# EAGLE design schematic_1.3 (EAGLE 7.3.0)
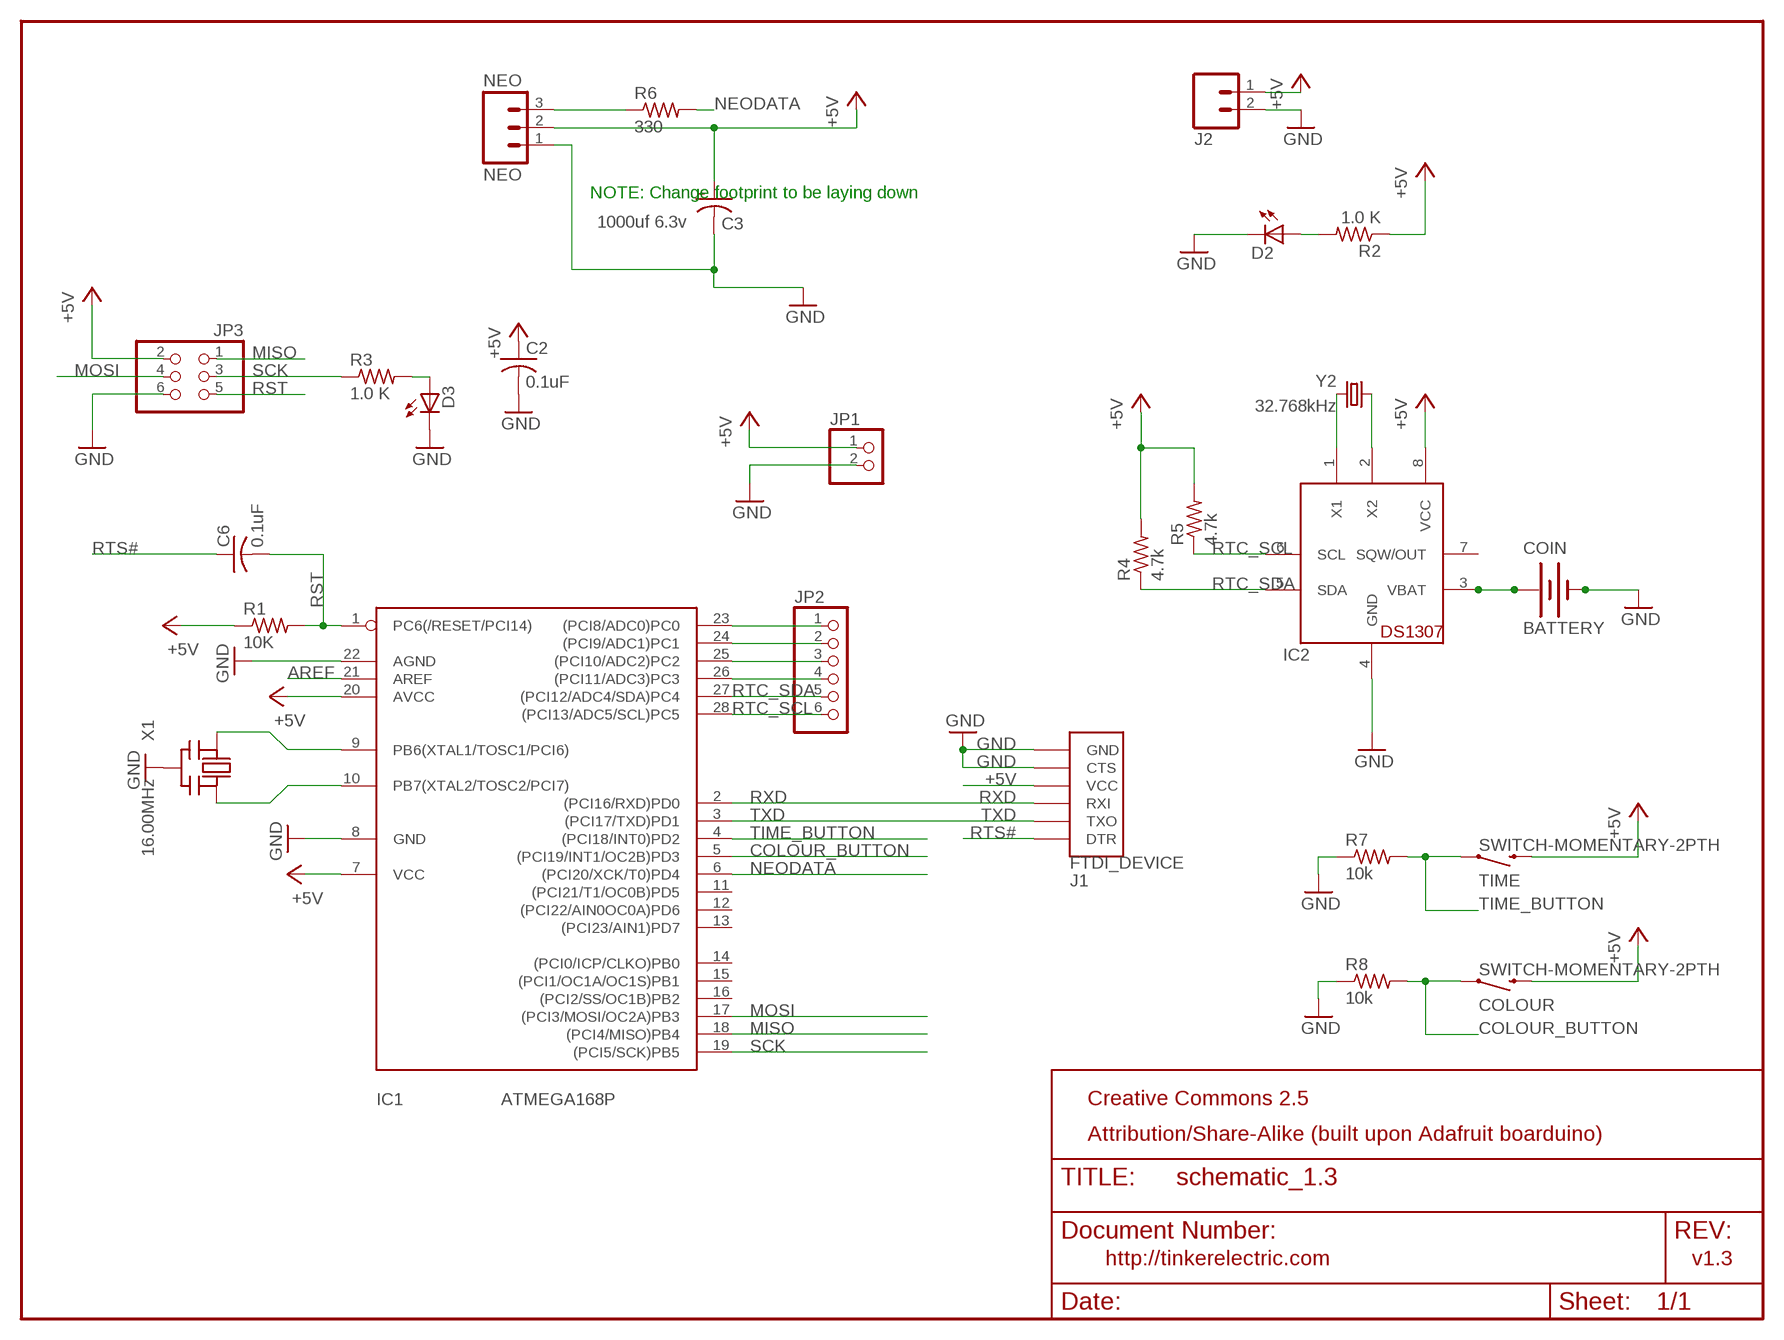
[diagram p0: schematic, sheet 1]

## Parts
C2  0.1uF  C-US025-025X050  [C025-025X050]
C3  1000uf 6.3v  CPOL-USE5-10.5  [E5-10,5]
C6  0.1uF  C-US025-025X050  [C025-025X050]
COIN  BATTERY  [BATTCOM_12MM]
COLOUR  SWITCH-MOMENTARY-2PTH  [TACTILE-PTH]
D2  LED3MM  [LED3MM]
D3  Green  LED3MM  [LED3MM]
IC1  ATMEGA168P  ATMEGA168PROUND  [DIL28/3]
IC2  DS1307  [DIL08]
J1  FTDI_DEVICE  [FTDI_DEVICE_SIDE]
J2  M02POLAR  [MOLEX-1X2]
JP1  PINHD-1X2CB  [1X02-CB]
JP2  PINHD-1X6CB  [1X06-CLEANBIG]
JP3  PINHD-2X3  [2X03]
NEO  NEO  M03POLAR  [MOLEX-1X3]
R1  10K  R-US_0204/2V  [0204V]
R2  1.0 K  R-US_0204/2V  [0204V]
R3  1.0 K  R-US_0204/2V  [0204V]
R4  4.7k  R-US_0204/2V  [0204V]
R5  4.7k  R-US_0204/2V  [0204V]
R6  330  R-US_0204/2V  [0204V]
R7  10k  R-US_0204/2V  [0204V]
R8  10k  R-US_0204/2V  [0204V]
TIME  SWITCH-MOMENTARY-2PTH  [TACTILE-PTH]
X1  16.00MHz  CERMOSCILL  [CERM_OSC]
Y2  32.768kHz  CRYSTALTC26H_EZ  [TC26HEZ]

## Nets
+5V: C2.1 C3.+ COLOUR.3 IC1.7(VCC) IC1.20(AVCC) IC2.8(VCC) J1.P$4(VCC) J2.1 JP1.1 JP3.2 NEO.2 R1.1 R2.1 R4.2 R5.2 TIME.3
AREF: IC1.21(AREF)
COLOUR_BUTTON: COLOUR.1 IC1.5((PCI19/INT1/OC2B)PD3) R8.2
GND: C2.2 C3.- COIN.- D2.K(C) D3.K(C) IC1.8(GND) IC1.22(AGND) IC2.4(GND) J1.P$5(CTS) J1.P$6(GND) J2.2 JP1.2 JP3.6 NEO.1 R7.1 R8.1 X1.P$2(GND)
MISO: IC1.18((PCI4/MISO)PB4) JP3.1
MOSI: IC1.17((PCI3/MOSI/OC2A)PB3) JP3.4
N$1: IC1.9(PB6(XTAL1/TOSC1/PCI6)) X1.P$1(IN)
N$2: IC1.10(PB7(XTAL2/TOSC2/PCI7)) X1.P$3(OUT)
N$3: D2.A R2.2
N$4: D3.A R3.2
N$5: NEO.3 R6.1
N$6: IC2.2(X2) Y2.1
N$7: IC2.1(X1) Y2.2
N$8: COIN.+ IC2.3(VBAT)
N$9: IC1.23((PCI8/ADC0)PC0) JP2.1
N$10: IC1.24((PCI9/ADC1)PC1) JP2.2
N$11: IC1.25((PCI10/ADC2)PC2) JP2.3
N$12: IC1.26((PCI11/ADC3)PC3) JP2.4
NEODATA: IC1.6((PCI20/XCK/T0)PD4) R6.2
RST: C6.2 IC1.1(PC6(/RESET/PCI14)) JP3.5 R1.2
RTC_SCL: IC1.28((PCI13/ADC5/SCL)PC5) IC2.6(SCL) JP2.6 R5.1
RTC_SDA: IC1.27((PCI12/ADC4/SDA)PC4) IC2.5(SDA) JP2.5 R4.1
RTS#: C6.1 J1.P$1(DTR)
RXD: IC1.2((PCI16/RXD)PD0) J1.P$3(RXI)
SCK: IC1.19((PCI5/SCK)PB5) JP3.3 R3.1
TIME_BUTTON: IC1.4((PCI18/INT0)PD2) R7.2 TIME.1
TXD: IC1.3((PCI17/TXD)PD1) J1.P$2(TXO)
Unconnected: IC1.11((PCI21/T1/OC0B)PD5) IC1.12((PCI22/AIN0OC0A)PD6) IC1.13((PCI23/AIN1)PD7) IC1.14((PCI0/ICP/CLKO)PB0) IC1.15((PCI1/OC1A/OC1S)PB1) IC1.16((PCI2/SS/OC1B)PB2) IC2.7(SQW/OUT)

## Notes on the sheet
- NOTE: Change footprint to be laying down
- Creative Commons 2.5
- Attribution/Share-Alike (built upon Adafruit boarduino)
- http://tinkerelectric.com | v1.3

## Library data of the parts
C2 C6 = minimidi:C-US: CAPACITOR, American symbol
C3 = adafruit:CPOL-US: POLARIZED CAPACITOR, American symbol
COIN = TinkerElectric:BATTERY: 12MM Coincell Holder 12mm diameter Keystone 500 RS-Components 430-653
COLOUR TIME = SparkFun-Electromechanical:SWITCH-MOMENTARY-2: Various NO switches- pushbuttons, reed, etc; PROD_ID: SWCH-08441
D2 D3 = minimidi:LED: LED OSRAM: - CHIPLED LG R971, LG N971, LY N971, LG Q971, LY Q971, LO R971, LY R971 LH N974, LH R974 LS Q976, LO Q976, LY Q976 LO Q996 - Hyper CHIPLED LW Q18S LB Q993, LB Q99A, LB R99A - SideLED LS A670, LO A670, LY A670, LG A670, LP A670 LB A673, LV A673, LT A673, LW A673 LH A674 LY A675 LS A676, LA A676, LO A676, LY A676, LW A676 LS A679, LY A679, LG A679 - Hyper Micro SIDELED® LS Y876, LA Y876, LO Y876, LY Y876 LT Y87S - SmartLED LW L88C, LW L88S LB L89C, LB L89S, LG L890 LS L89K, LO L89K, LY L89K LS L896, LA L896, LO L896, LY L896 - TOPLED LS T670, LO T670, LY T670, LG T670, LP T670 LSG T670, LSP T670, LSY T670, LOP T670, LYG T670 LG T671, LOG T671, LSG T671 LB T673, LV T673, LT T673, LW T673 LH T674 LS T676, LA T676, LO T676, LY T676, LB T676, LH T676, LSB T676, LW T676 LB T67C, LV T67C, LT T67C, LS T67K, LO T67K, LY T67K, LW E67C LS E67B, LA E67B, LO E67B, LY E67B, LB E67C, LV E67C, LT E67C LW T67C LS T679, LY T679, LG T679 LS T770, LO T770, LY T770, LG T770, LP T770 LB T773, LV T773, LT T773, LW T773 LH T774 LS E675, LA E675, LY E675, LS T675 LS T776, LA T776, LO T776, LY T776, LB T776 LHGB T686 LT T68C, LB T68C - Hyper Mini TOPLED® LB M676 - Mini TOPLED Santana® LG M470 LS M47K, LO M47K, LY M47K Source: http://www.osram.convergy.de/
IC1 = avr:ATMEGA168*P: MICROCONTROLLER 16 kBytes FLASH 1 kBytes SRAM 512 Bytes EEPROM USART 8-channel 10 bit ADC
IC2 = adafruit:DS1307: DS1307 Real time clock (RTC) with battery backup ability. Talk to it via i2c
J1 = SparkFun-Connectors:FTDI_DEVICE: Connector which mates to FTDI basic or FTDI cable.
J2 = SparkFun-Connectors:M02: Standard 2-pin 0.1" header. Use with - straight break away headers ( PRT-00116) - right angle break away headers (PRT-00553) - swiss pins (PRT-00743) - machine pins (PRT-00117) - female headers (PRT-00115) Molex polarized connector foot print use with: PRT-08233 with associated crimp pins and housings. 2.54_SCREWTERM for use with PRT-10571. 3.5mm Screw Terminal footprints for PRT-08084 5mm Screw Terminal footprints for use with PRT-08432
JP1 = carduino:PINHD-1X2: PIN HEADER
JP2 = carduino:PINHD-1X6: PIN HEADER
JP3 = pinhead-ez:PINHD-2X3: PIN HEADER
NEO = SparkFun-Connectors:M03: Header 3 Standard 3-pin 0.1" header. Use with straight break away headers (SKU : PRT-00116), right angle break away headers (PRT-00553), swiss pins (PRT-00743), machine pins (PRT-00117), and female headers (PRT-00115). Molex polarized connector foot print use with SKU : PRT-08232 with associated crimp pins and housings.
R1-R8 = adafruit:R-US_: RESISTOR, American symbol
X1 = digg:CERMOSCILL
Y2 = SparkFun-FreqCtrl:CRYSTAL: Various standard crystals. Proven footprints.

## Net classes
0 default: width 0.127 mm, drill 0.127 mm, clearance 0.127 mm

## Board
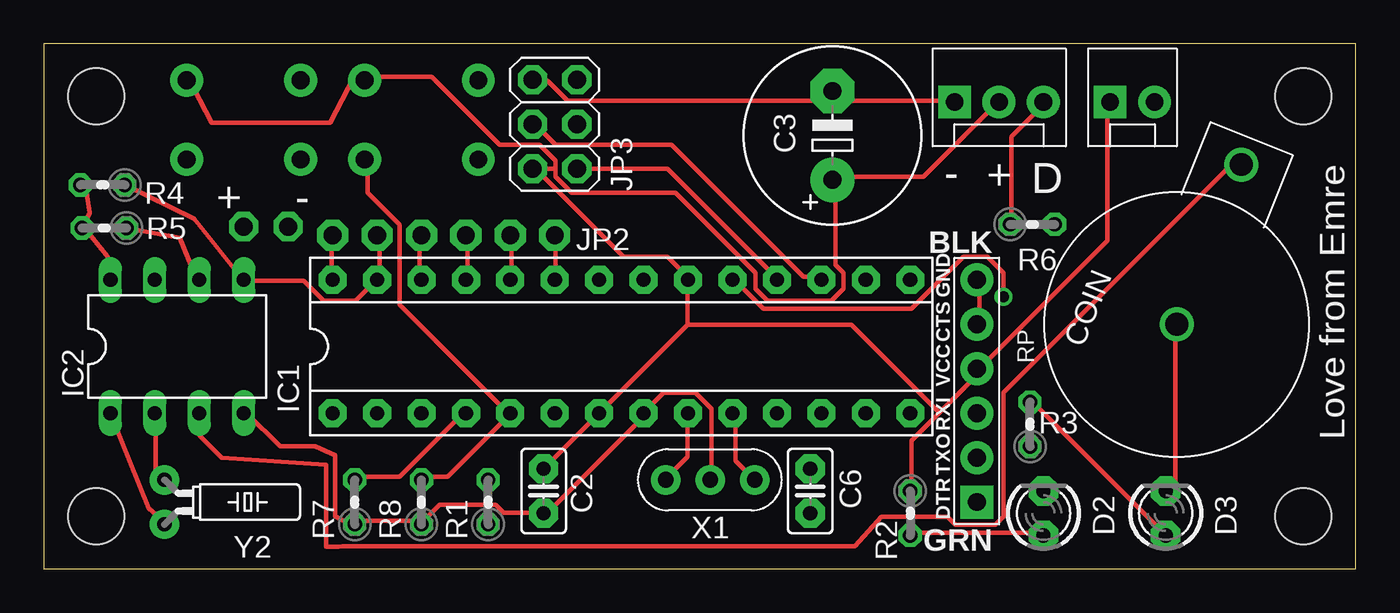
[diagram p1: board, top side]
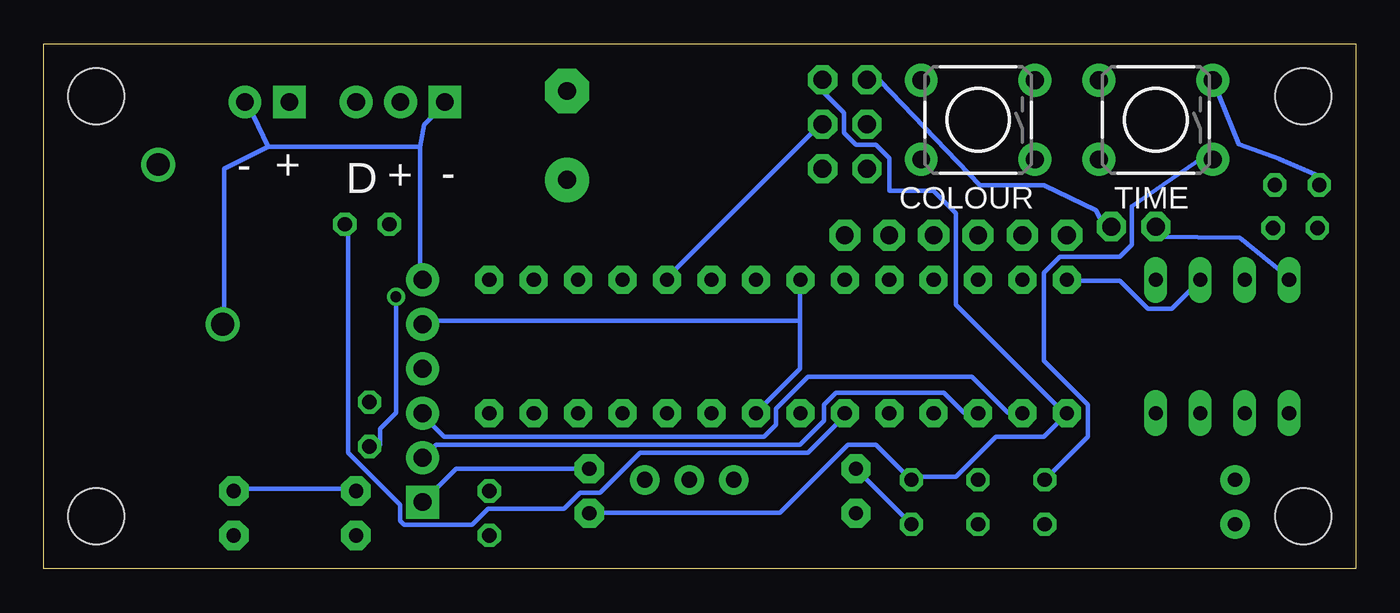
[diagram p2: board, bottom side, seen from below]

Size 75 x 30 mm. Coordinates in mm from the lower left corner, seen from the top.
Outline: 0,0 75,0 75,30 0,30 0,0
Copper layers (1*16): Top 0.035mm / dielectric 1.5mm / Bottom 0.035mm
Design rules "default": minimum track width 10mil, minimum drill 24mil, track to track 8mil, track to pad 8mil, pad to pad 8mil, via to via 8mil, smd to smd 8mil, copper to edge 40mil, drill to drill 8mil, minimum pad ring 10mil, minimum via ring 8mil, stop-mask expansion 4mil, vias tented up to drill 0mil, thermal gap 10mil
Holes 3.2 mm at 3,3 3,27 72,3 72,27

### Footprints (pad centres in the part's own frame; a part is rotated, then mirrored left to right if it is on the bottom)
C025-025X050 = drill 0.813 pad 1.676 octagon: 1 -1.27,0; 2 1.27,0
E5-10,5 = drill 1.016 pad 2.54: + -2.54,0 | drill 1.016 pad 2.54 octagon: - 2.54,0
BATTCOM_12MM = drill 1.3: + 9.842,0; - 0,0
TACTILE-PTH = drill 1.016 pad 1.88: 1 -3.251,2.261; 2 3.251,2.261; 3 -3.251,-2.261; 4 3.251,-2.261
LED3MM = drill 0.813 pad 1.676 octagon: A -1.27,0; K 1.27,0
DIL28/3 = drill 0.813 pad 1.6 octagon: 1 -16.51,-3.81; 2 -13.97,-3.81; 3 -11.43,-3.81; 4 -8.89,-3.81; 5 -6.35,-3.81; 6 -3.81,-3.81; 7 -1.27,-3.81; 8 1.27,-3.81; 9 3.81,-3.81; 10 6.35,-3.81; 11 8.89,-3.81; 12 11.43,-3.81; 13 13.97,-3.81; 14 16.51,-3.81; 15 16.51,3.81; 16 13.97,3.81; 17 11.43,3.81; 18 8.89,3.81; 19 6.35,3.81; 20 3.81,3.81; 21 1.27,3.81; 22 -1.27,3.81; 23 -3.81,3.81; 24 -6.35,3.81; 25 -8.89,3.81; 26 -11.43,3.81; 27 -13.97,3.81; 28 -16.51,3.81
DIL08 = drill 0.813 long: 1 -3.81,-3.81; 2 -1.27,-3.81; 3 1.27,-3.81; 4 3.81,-3.81; 5 3.81,3.81; 6 1.27,3.81; 7 -1.27,3.81; 8 -3.81,3.81
FTDI_DEVICE_SIDE = drill 1.016 pad 1.88 square: P$1 -6.35,0 | drill 1.016 pad 1.88: P$2 -3.81,0; P$3 -1.27,0; P$4 1.27,0; P$5 3.81,0; P$6 6.35,0
MOLEX-1X2 = drill 1.016 pad 1.88 square: 1 0,0 | drill 1.016 pad 1.88: 2 2.54,0
1X02-CB = drill 1.016 pad 1.676 octagon: 1 -1.27,0; 2 1.27,0
1X06-CLEANBIG = drill 1.016 pad 1.778 octagon: 1 -6.35,0; 2 -3.81,0; 3 -1.27,0; 4 1.27,0; 5 3.81,0; 6 6.35,0
2X03 = drill 1.016 pad 1.676 octagon: 1 -2.54,-1.27; 2 -2.54,1.27; 3 0,-1.27; 4 0,1.27; 5 2.54,-1.27; 6 2.54,1.27
MOLEX-1X3 = drill 1.016 pad 1.88 square: 1 0,0 | drill 1.016 pad 1.88: 2 2.54,0; 3 5.08,0
0204V = drill 0.813 octagon: 1 -1.27,0; 2 1.27,0
CERM_OSC = drill 0.9 pad 1.676: P$1 -2.54,0; P$2 0,0; P$3 2.54,0
TC26HEZ = drill 0.813 pad 1.676: 1 -1.27,0; 2 1.27,0

### Placement (x,y rotation side)
C2  28.57,4.45 270 top
C3  45.09,24.77 90 top
C6  43.81,4.45 270 top
COIN  64.77,13.97 68 top
COLOUR  21.59,25.65 180 bottom
D2  57.15,3.17 90 top
D3  64.14,3.17 90 top
IC1  33.02,12.7 0 top
IC2  7.62,12.7 0 top
J1  53.34,10.16 90 top
J2  60.96,26.67 0 top
JP1  12.7,19.55 0 top
JP2  22.86,19.05 180 top
JP3  29.21,25.4 90 top
NEO  52.07,26.67 0 top
R1  25.4,3.81 90 top
R2  49.53,3.17 270 top
R3  56.38,8.26 90 top
R4  3.36,21.93 180 top
R5  3.46,19.47 180 top
R6  56.52,19.68 0 top
R7  17.78,3.81 90 top
R8  21.59,3.81 90 top
TIME  11.43,25.65 180 bottom
X1  38.1,5.08 0 top
Y2  6.9,3.81 270 top

### Tracks (layer width: path | path; a pad name or v marks a point on that pad's centre or on a via)
+5V
  Top 0.254: NEO.2 54.41,26.52 50.29,22.4 45.26,22.4 C3.+ 45.26,22.17 45.26,17.37 45.72,16.92 45.72,16 45.03,15.32 41.38,15.32 40.69,16 40.69,16.92 36.12,21.49 30.18,21.49 29.26,22.4 29.26,22.86 | R4.2 2.39,21.8 2.64,20.34 R5.2 2.34,19.47 3.66,17.83 3.66,16.69 IC2.8 | 8.13,28.12 8,28.12 TIME.3 8.23,28.12 9.6,25.48 16.36,25.48 17.73,28.12 18.29,28.12 COLOUR.3 18.52,28.12 22.17,28.12 26.06,24.23 28.35,24.23 29.26,23.32 29.26,22.86 | C2.1 IC1.7 36.8,13.95 | 36.8,13.95 36.8,16.46 IC1.20 36.8,16.69 35.66,17.83 33.15,17.83 28.12,22.86 | 28.12,22.86 JP3.2 | 51.21,8.91 53.26,10.97 53.26,11.43 J1.P$4 53.49,11.43 60.81,18.75 60.81,26.52 J2.1 | 51.21,8.91 49.61,7.32 49.61,4.57 R2.1 | 36.8,13.95 46.18,13.95 51.21,8.91 | 28.12,22.86 29.26,22.86
  Bottom 0.254: JP1.1 11.43,18.97 6.62,18.92 3.89,16.69 IC2.8 | R4.2 2.14,22.46 4.35,23.4 4.37,23.42 6.7,24.26 TIME.3 | C2.1 R1.1
COLOUR_BUTTON
  Top 0.254: R8.2 21.72,5.26 23.09,5.26 26.52,8.69 IC1.5 26.52,8.91 20.34,15.09 20.34,19.66 18.52,21.49 18.52,23.55 COLOUR.1
GND
  Top 0.254: X1.P$2 38.18,5.26 38.18,9.14 37.26,10.06 35.43,10.06 34.29,8.91 IC1.8 34.29,8.69 28.57,2.97 C2.2 28.57,3.2 26.29,3.2 25.83,3.66 22.63,3.66 21.72,2.74 R8.1 21.49,2.74 17.83,2.74 R7.1 | 17.6,2.52 R7.1 | COIN.- 64.69,13.95 64.69,5.03 64.24,4.57 D3.K | J1.P$5 53.49,14.17 53.49,16.46 J1.P$6 | NEO.1 51.89,26.75 45.72,26.75 45.26,27.2 C3.- 45.03,27.2 44.58,26.75 29.95,26.75 28.8,27.89 28.12,27.89 JP3.6 | IC2.4 11.61,8.89 13.5,7 15.5,7 16.65,6.5 16.65,3 17.6,2.5 17.74,2.5 R7.1
  Bottom 0.254: 31.77,14.17 31.77,11.43 34.29,8.91 IC1.8 | 31.77,14.17 31.77,16.46 IC1.22 | JP1.2 14.17,19.2 14.86,20.47 17.83,21.92 21.49,21.92 27.2,27.89 27.89,27.89 JP3.6 | D2.K 57.15,4.57 64.01,4.57 D3.K | 62.18,24.11 63.32,26.52 J2.2 | 53.49,24.11 53.26,25.38 52.12,26.52 NEO.1 | 53.49,24.11 62.18,24.11 | 53.49,24.11 53.49,16.69 J1.P$6 | 62.18,24.11 64.69,22.86 64.69,14.17 COIN.- | 31.77,14.17 53.26,14.17 J1.P$5
MISO
  Top 0.254: JP3.1 35.66,22.86 41.83,16.69 IC1.18
MOSI
  Top 0.254: IC1.17 44.35,16.69 43.43,16.69 35.89,24.23 29.26,24.23 28.12,25.38 JP3.4
N$1
  Top 0.254: IC1.9 36.8,8.69 36.8,6.4 35.66,5.26 X1.P$1
N$2
  Top 0.254: X1.P$3 39.55,6.17 39.55,8.69 IC1.10
N$3
  Top 0.254: R2.2 49.61,2.06 57.15,2.06 D2.A
N$4
  Top 0.254: R3.2 56.28,9.37 56.69,9.37 64.01,2.06 D3.A
N$5
  Top 0.254: R6.1 55.32,19.89 55.32,24.69 57.15,26.52 NEO.3
N$6
  Top 0.254: IC2.2 6.4,8.69 6.4,5.26 Y2.1
N$7
  Top 0.254: IC2.1 3.89,8.69 6.01,3.46 6.82,2.74 Y2.2
N$8
  Top 0.254: IC2.3 8.91,8.69 8.91,7.59 10.16,6.35 16.14,5.95 16.14,1.27 16.86,1.27 17.06,1.27 46.38,1.27 47.88,2.97 51.66,2.97 52.12,2.52 54.41,2.52 54.86,2.97 54.86,10.06 67.89,23.09 68.35,23.09 COIN.+
N$9
  Top 0.254: IC1.23 29.26,16.69 29.26,18.97 JP2.1
N$10
  Top 0.254: IC1.24 26.75,16.69 26.75,18.97 JP2.2
N$11
  Top 0.254: IC1.25 24.23,16.69 24.23,18.97 JP2.3
N$12
  Top 0.254: IC1.26 21.49,16.69 21.49,18.97 JP2.4
NEODATA
  Bottom 0.254: R6.2 57.61,19.66 57.61,6.63 54.63,3.66 54.63,2.74 54.41,2.52 50.52,2.52 49.61,3.43 45.26,3.43 44.35,4.34 43.2,4.34 40.92,6.63 31.32,6.63 29.26,8.69 IC1.6
RST
  Bottom 0.254: JP3.5 30.4,27.89 30.4,27.2 29.26,26.06 29.26,24.92 28.57,24.23 27.43,24.23 26.67,23.47 26.67,21.59 24.13,21.59 22.86,20.32 22.86,15.09 16.69,8.91 IC1.1 16.69,8.69 17.83,7.54 20.57,7.54 22.86,5.26 25.38,5.26 R1.2 25.6,5.26 27.43,7.09 29.03,7.09 32.92,3.2 43.66,3.2 C6.2
RTC_SCL
  Top 0.254: IC1.28 16.46,16.69 16.46,18.97 JP2.6 | IC2.6 8.69,16.69 7.76,18.92 4.91,19.42 R5.1
  Bottom 0.254: IC1.28 16.46,16.46 13.49,16.46 11.89,14.86 10.52,14.86 8.91,16.46 IC2.6
RTC_SDA
  Top 0.254: 11.43,16.46 14.86,16.46 16,15.32 17.83,15.32 18.97,16.46 IC1.27 19.2,16.69 19.2,18.97 JP2.5 | 11.43,16.46 8.59,20 R4.1 | 11.43,16.46 IC2.5
RTS#
  Bottom 0.254: C6.1 51.44,5.71 J1.P$1
RXD
  Bottom 0.254: IC1.2 19.2,8.91 19.89,8.91 21.95,10.97 31.32,10.97 33.15,9.14 33.15,8.23 33.83,7.54 52.12,7.54 53.26,8.69 J1.P$3
SCK  (via drill 0.61)
  Top 0.254: v54.86,15.54 54.86,16.92 53.95,17.83 52.58,17.83 49.61,14.86 41.15,14.86 39.55,16.46 IC1.19
  Bottom 0.254: v54.86,15.54 54.86,8.91 55.78,8 55.78,7.09 R3.1 | JP3.3 30.63,25.38 39.32,16.69 IC1.19
TIME_BUTTON
  Top 0.254: R7.2 17.83,5.26 20.34,5.26 24,8.91 IC1.4
  Bottom 0.254: R7.2 15.32,7.54 15.32,9.37 17.83,11.89 17.83,16.92 16.92,17.83 13.49,17.83 12.8,18.52 12.8,20.7 8.69,23.55 8.23,23.55 TIME.1
TXD
  Bottom 0.254: IC1.3 21.72,8.91 22.4,8.91 23.55,10.06 29.72,10.06 30.4,9.37 30.4,8.46 31.77,7.09 52.58,7.09 53.26,6.4 J1.P$2

### Text on the board
tNames: - | + | D | + | - | Love from Emre | RP
bNames: - | + | + | - | D